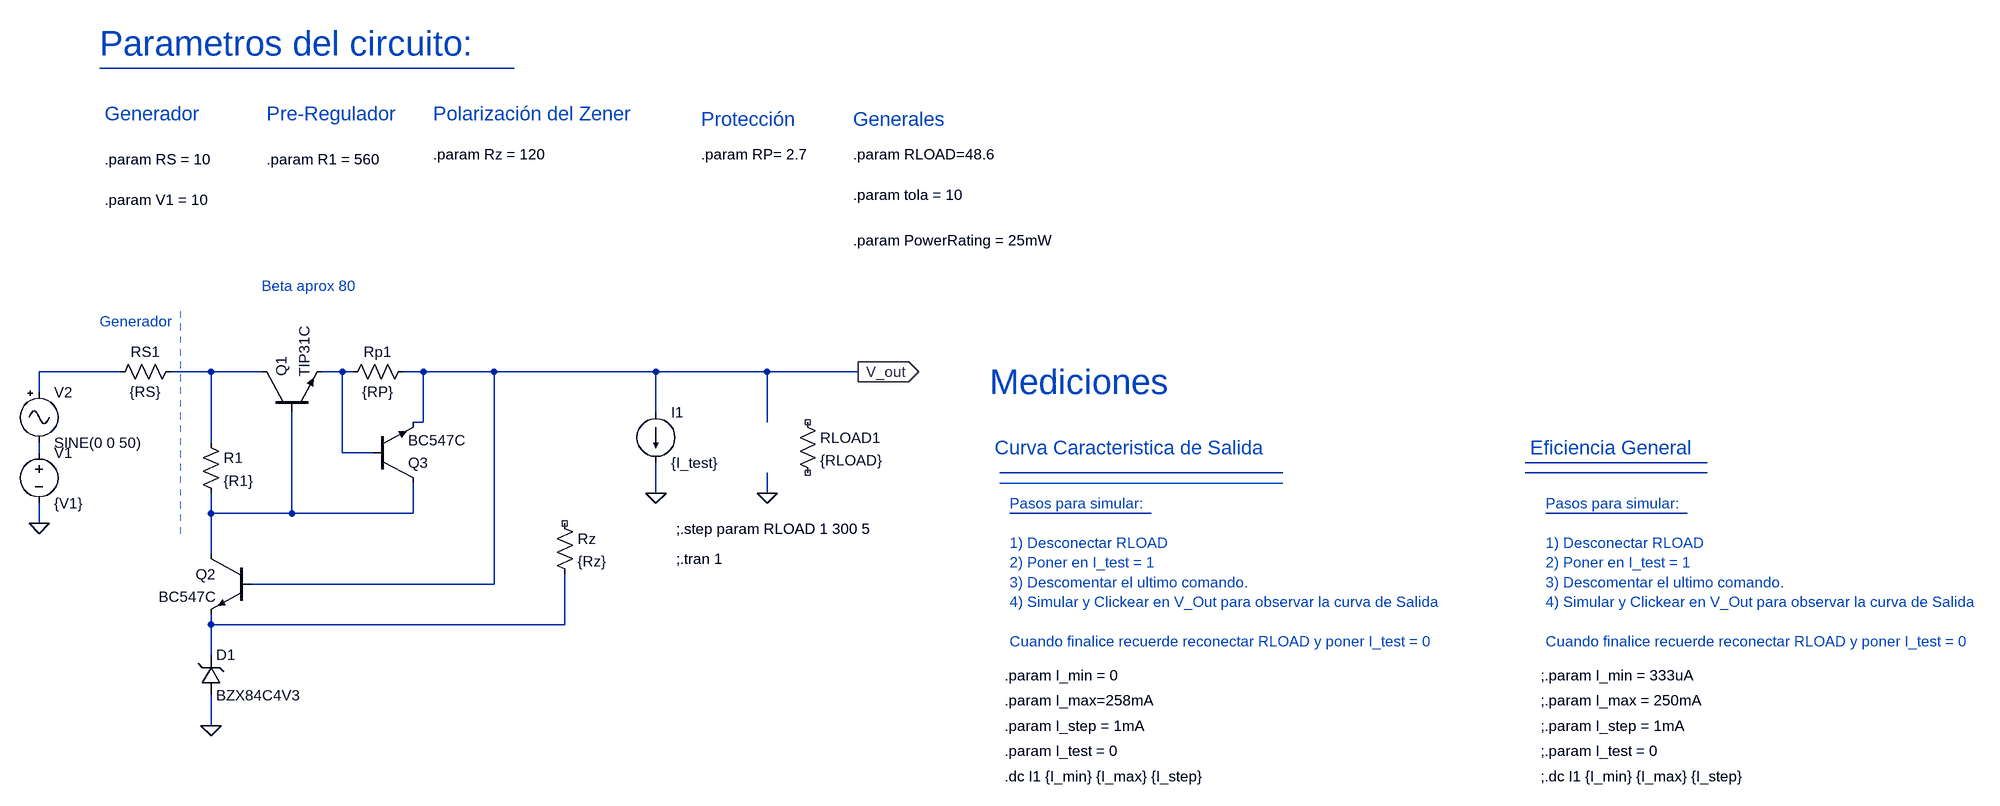
[diagram p0: schematic fuente.asc]
fuente.asc, the LTspice schematic file:
Version 4
SHEET 1 1956 836
WIRE -416 -336 -1072 -336
WIRE -1040 144 -1168 144
WIRE -896 144 -960 144
WIRE -816 144 -896 144
WIRE -688 144 -720 144
WIRE -672 144 -688 144
WIRE -560 144 -592 144
WIRE -448 144 -560 144
WIRE -192 144 -448 144
WIRE -16 144 -192 144
WIRE 128 144 -16 144
WIRE -1168 176 -1168 144
WIRE -192 208 -192 144
WIRE -560 224 -560 144
WIRE -560 224 -576 224
WIRE -16 224 -16 144
WIRE -896 256 -896 144
WIRE -1168 272 -1168 256
WIRE -688 272 -688 144
WIRE -640 272 -688 272
WIRE 1472 288 1184 288
WIRE 800 304 352 304
WIRE 1472 304 1184 304
WIRE -192 336 -192 288
WIRE -16 336 -16 304
WIRE -896 368 -896 336
WIRE -768 368 -768 208
WIRE -768 368 -896 368
WIRE -576 368 -576 320
WIRE -576 368 -768 368
WIRE 592 368 368 368
WIRE 1440 368 1216 368
WIRE -1168 384 -1168 352
WIRE -896 432 -896 368
WIRE -448 480 -448 144
WIRE -448 480 -832 480
WIRE -896 544 -896 528
WIRE -336 544 -336 464
WIRE -336 544 -896 544
WIRE -896 592 -896 544
WIRE -896 704 -896 656
FLAG -1168 384 0
FLAG -896 704 0
FLAG -16 336 0
FLAG -192 336 0
FLAG 128 144 V_out
IOPIN 128 144 Out
DATAFLAG -192 144 "I(Rload)"
DATAFLAG -16 144 ""
DATAFLAG -464 144 ""
DATAFLAG -896 144 ""
DATAFLAG -896 368 ""
SYMBOL voltage -1168 256 R0
WINDOW 123 0 0 Left 0
WINDOW 39 0 0 Left 0
SYMATTR InstName V1
SYMATTR Value {V1}
SYMBOL res -944 128 R90
WINDOW 0 0 56 VBottom 2
WINDOW 3 32 56 VTop 2
SYMATTR InstName RS1
SYMATTR Value {RS}
SYMATTR SpiceLine tol={tola} pwr={PowerRating }
SYMBOL npn -816 208 R270
SYMATTR InstName Q1
SYMATTR Value TIP31C
SYMBOL npn -832 432 M0
SYMATTR InstName Q2
SYMATTR Value BC547C
SYMBOL zener -912 656 M180
WINDOW 0 24 64 Left 2
WINDOW 3 24 0 Left 2
SYMATTR InstName D1
SYMATTR Value BZX84C4V3
SYMBOL res 32 208 R0
SYMATTR InstName RLOAD1
SYMATTR Value {RLOAD}
SYMATTR SpiceLine tol={tola} pwr={PowerRating}
SYMBOL res -576 128 R90
WINDOW 0 0 56 VBottom 2
WINDOW 3 32 56 VTop 2
SYMATTR InstName Rp1
SYMATTR Value {RP}
SYMATTR SpiceLine tol={tola} pwr={PowerRating}
SYMBOL res -912 240 R0
SYMATTR InstName R1
SYMATTR Value {R1}
SYMATTR SpiceLine tol={tola} pwr={PowerRating}
SYMBOL res -352 368 R0
SYMATTR InstName Rz
SYMATTR Value {Rz}
SYMATTR SpiceLine tol={tola} pwr={PowerRating}
SYMBOL current -192 208 R0
WINDOW 123 0 0 Left 0
WINDOW 39 0 0 Left 0
SYMATTR InstName I1
SYMATTR Value {I_test}
SYMBOL npn -640 320 M180
SYMATTR InstName Q3
SYMATTR Value BC547C
SYMBOL Misc\\signal -1168 160 R0
WINDOW 123 0 0 Left 0
WINDOW 39 0 0 Left 0
SYMATTR InstName V2
SYMATTR Value SINE(0 0 50)
TEXT -1072 64 Left 2 ;Generador
TEXT -816 8 Left 2 ;Beta aprox 80
TEXT -160 392 Left 2 !;.step param RLOAD 1 300 5
TEXT 336 160 Left 5 ;Mediciones
TEXT 344 264 Left 3 ;Curva Caracteristica de Salida
TEXT 360 624 Left 2 !.param I_min = 0
TEXT 360 664 Left 2 !.param I_max=258mA
TEXT 360 704 Left 2 !.param I_step = 1mA
TEXT 360 744 Left 2 !.param I_test = 0
TEXT 368 352 Left 2 ;Pasos para simular:\n \n1) Desconectar RLOAD\n2) Poner en I_test = 1\n3) Descomentar el ultimo comando.\n4) Simular y Clickear en V_Out para observar la curva de Salida\n \nCuando finalice recuerde reconectar RLOAD y poner I_test = 0
TEXT -1072 -376 Left 5 ;Parametros del circuito:
TEXT -1064 -192 Left 2 !.param RS = 10
TEXT -1064 -128 Left 2 !.param V1 = 10
TEXT -808 -192 Left 2 !.param R1 = 560
TEXT -1064 -264 Left 3 ;Generador
TEXT -808 -264 Left 3 ;Pre-Regulador
TEXT -544 -264 Left 3 ;Polarización del Zener
TEXT -544 -200 Left 2 !.param Rz = 120
TEXT -120 -200 Left 2 !.param RP= 2.7
TEXT -160 440 Left 2 !;.tran 1
TEXT -120 -256 Left 3 ;Protección
TEXT 1208 784 Left 2 !;.dc I1 {I_min} {I_max} {I_step}
TEXT 1192 264 Left 3 ;Eficiencia General
TEXT 1208 624 Left 2 !;.param I_min = 333uA
TEXT 1208 664 Left 2 !;.param I_max = 250mA
TEXT 1208 704 Left 2 !;.param I_step = 1mA
TEXT 1208 744 Left 2 !;.param I_test = 0
TEXT 1216 352 Left 2 ;Pasos para simular:\n \n1) Desconectar RLOAD\n2) Poner en I_test = 1\n3) Descomentar el ultimo comando.\n4) Simular y Clickear en V_Out para observar la curva de Salida\n \nCuando finalice recuerde reconectar RLOAD y poner I_test = 0
TEXT 120 -136 Left 2 !.param tola = 10
TEXT 120 -200 Left 2 !.param RLOAD=48.6
TEXT 120 -256 Left 3 ;Generales
TEXT 120 -64 Left 2 !.param PowerRating = 25mW
TEXT 360 784 Left 2 !.dc I1 {I_min} {I_max} {I_step}
LINE Normal -944 400 -944 48 2
LINE Normal 800 320 352 320

The netlist it stands for:
* fuente.asc
V1 N005 0 {V1}
RS1 N003 N002 {RS} tol={tola} pwr={PowerRating }
Q1 N003 N009 N004 0 TIP31C
Q2 N009 V_out N012 0 BC547C
D1 0 N012 BZX84C4V3
RLOAD1 NC_01 NC_02 {RLOAD} tol={tola} pwr={PowerRating}
Rp1 V_out N004 {RP} tol={tola} pwr={PowerRating}
R1 N003 N009 {R1} tol={tola} pwr={PowerRating}
Rz NC_03 N012 {Rz} tol={tola} pwr={PowerRating}
I1 V_out 0 {I_test}
Q3 N009 N004 V_out 0 BC547C
V2 N002 N005 SINE(0 0 50)
.model D D
.lib standard.dio
.model NPN NPN
.model PNP PNP
.lib standard.bjt
* Generador
* Beta aprox 80
;.step param RLOAD 1 300 5
* Mediciones
* Curva Caracteristica de Salida
.param I_min = 0
.param I_max=258mA
.param I_step = 1mA
.param I_test = 0
* Pasos para simular:
* 1) Desconectar RLOAD
* 2) Poner en I_test = 1
* 3) Descomentar el ultimo comando.
* 4) Simular y Clickear en V_Out para observar la curva de Salida
* Cuando finalice recuerde reconectar RLOAD y poner I_test = 0
* Parametros del circuito:
.param RS = 10
.param V1 = 10
.param R1 = 560
* Generador
* Pre-Regulador
* Polarización del Zener
.param Rz = 120
.param RP= 2.7
;.tran 1
* Protección
;.dc I1 {I_min} {I_max} {I_step}
* Eficiencia General
;.param I_min = 333uA
;.param I_max = 250mA
;.param I_step = 1mA
;.param I_test = 0
* Pasos para simular:
* 1) Desconectar RLOAD
* 2) Poner en I_test = 1
* 3) Descomentar el ultimo comando.
* 4) Simular y Clickear en V_Out para observar la curva de Salida
* Cuando finalice recuerde reconectar RLOAD y poner I_test = 0
.param tola = 10
.param RLOAD=48.6
* Generales
.param PowerRating = 25mW
.dc I1 {I_min} {I_max} {I_step}
.backanno
.end